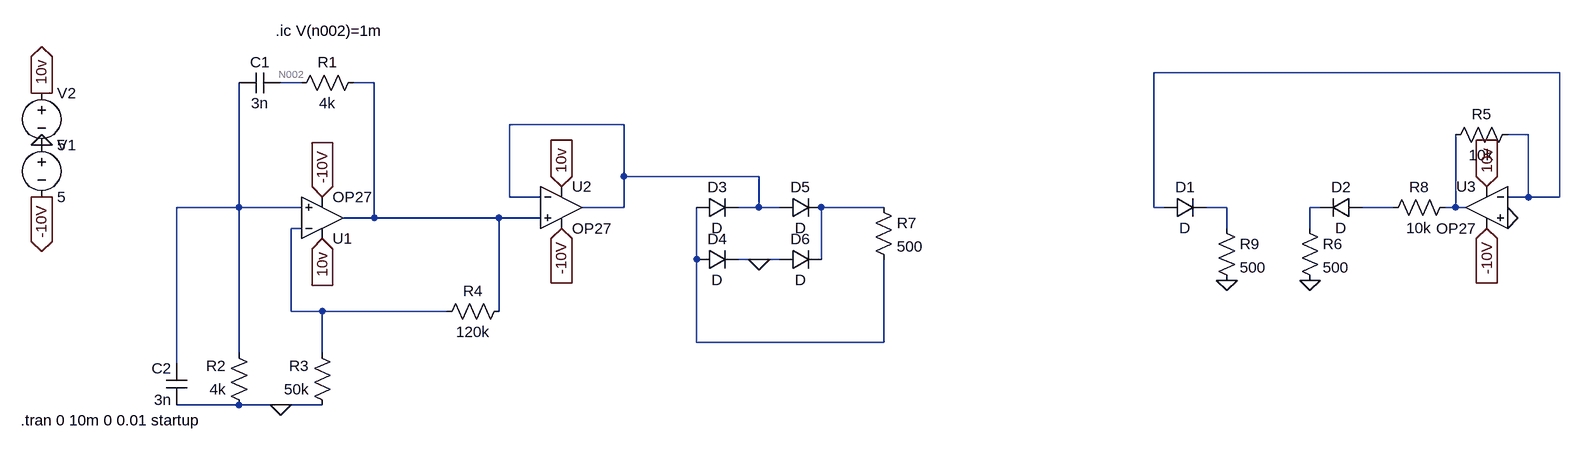
[diagram p0: schematic oscillator.asc]
oscillator.asc, the LTspice schematic file:
Version 4
SHEET 1 2164 680
WIRE 2160 -160 1536 -160
WIRE 224 -144 192 -144
WIRE 336 -144 304 -144
WIRE 720 -80 544 -80
WIRE 2112 -64 2080 -64
WIRE 720 0 720 -80
WIRE 928 0 720 0
WIRE 544 32 544 -80
WIRE 592 32 544 32
WIRE 2112 32 2112 -64
WIRE 2112 32 2080 32
WIRE 2160 32 2160 -160
WIRE 2160 32 2112 32
WIRE 128 48 128 -144
WIRE 128 48 32 48
WIRE 224 48 128 48
WIRE 720 48 720 0
WIRE 720 48 656 48
WIRE 928 48 928 0
WIRE 928 48 896 48
WIRE 960 48 928 48
WIRE 1120 48 1024 48
WIRE 1536 48 1536 -160
WIRE 1552 48 1536 48
WIRE 1648 48 1616 48
WIRE 1792 48 1776 48
WIRE 1904 48 1856 48
WIRE 2000 48 2000 -64
WIRE 2000 48 1984 48
WIRE 2016 48 2000 48
WIRE 336 64 336 -144
WIRE 336 64 288 64
WIRE 528 64 336 64
WIRE 592 64 528 64
WIRE 224 80 208 80
WIRE 1648 80 1648 48
WIRE 1776 80 1776 48
WIRE 832 128 832 48
WIRE 928 128 896 128
WIRE 960 128 928 128
WIRE 1024 128 1024 48
WIRE 208 208 208 80
WIRE 256 208 208 208
WIRE 448 208 256 208
WIRE 528 208 528 64
WIRE 832 256 832 128
WIRE 1120 256 1120 128
WIRE 1120 256 832 256
WIRE 128 272 128 48
WIRE 256 272 256 208
WIRE 32 288 32 48
WIRE 128 352 32 352
WIRE 192 352 128 352
WIRE 256 352 192 352
FLAG 192 352 0
FLAG 256 32 -10V
IOPIN 256 32 In
FLAG -176 -48 0
FLAG -176 -128 10v
IOPIN -176 -128 Out
FLAG 256 96 10v
IOPIN 256 96 In
FLAG -176 32 -10V
IOPIN -176 32 Out
FLAG 1648 160 0
FLAG 2080 64 0
FLAG 2048 80 -10V
IOPIN 2048 80 In
FLAG 624 80 -10V
IOPIN 624 80 In
FLAG 624 16 10v
IOPIN 624 16 In
FLAG 2048 16 10v
IOPIN 2048 16 In
FLAG 1776 160 0
FLAG 928 128 0
SYMBOL res 320 -160 R90
WINDOW 0 0 56 VBottom 2
WINDOW 3 32 56 VTop 2
SYMATTR InstName R1
SYMATTR Value 4k
SYMBOL res 144 368 R180
WINDOW 0 36 76 Left 2
WINDOW 3 36 40 Left 2
SYMATTR InstName R2
SYMATTR Value 4k
SYMBOL res 272 368 R180
WINDOW 0 36 76 Left 2
WINDOW 3 36 40 Left 2
SYMATTR InstName R3
SYMATTR Value 50k
SYMBOL res 432 224 R270
WINDOW 0 32 56 VTop 2
WINDOW 3 0 56 VBottom 2
SYMATTR InstName R4
SYMATTR Value 120k
SYMBOL cap 192 -160 R90
WINDOW 0 0 32 VBottom 2
WINDOW 3 32 32 VTop 2
SYMATTR InstName C1
SYMATTR Value 3n
SYMBOL cap 48 352 R180
WINDOW 0 24 56 Left 2
WINDOW 3 24 8 Left 2
SYMATTR InstName C2
SYMATTR Value 3n
SYMBOL voltage -176 -144 R0
WINDOW 123 0 0 Left 0
WINDOW 39 0 0 Left 0
SYMATTR InstName V2
SYMATTR Value 5
SYMBOL OpAmps\\OP27 256 128 M180
SYMATTR InstName U1
SYMBOL voltage -176 -64 R0
WINDOW 123 0 0 Left 0
WINDOW 39 0 0 Left 0
SYMATTR InstName V1
SYMATTR Value 5
SYMBOL OpAmps\\OP27 624 -16 R0
SYMATTR InstName U2
SYMBOL OpAmps\\OP27 2048 -16 M0
SYMATTR InstName U3
SYMBOL diode 1552 64 R270
WINDOW 0 32 32 VTop 2
WINDOW 3 0 32 VBottom 2
SYMATTR InstName D1
SYMBOL diode 1856 64 M270
WINDOW 0 32 32 VTop 2
WINDOW 3 0 32 VBottom 2
SYMATTR InstName D2
SYMBOL res 2096 -80 R90
WINDOW 0 0 56 VBottom 2
WINDOW 3 32 56 VTop 2
SYMATTR InstName R5
SYMATTR Value 10k
SYMBOL res 2000 32 R90
WINDOW 0 0 56 VBottom 2
WINDOW 3 32 56 VTop 2
SYMATTR InstName R8
SYMATTR Value 10k
SYMBOL res 1632 64 R0
SYMATTR InstName R9
SYMATTR Value 500
SYMBOL res 1760 64 R0
SYMATTR InstName R6
SYMATTR Value 500
SYMBOL diode 832 64 R270
WINDOW 0 32 32 VTop 2
WINDOW 3 0 32 VBottom 2
SYMATTR InstName D3
SYMBOL diode 832 144 R270
WINDOW 0 32 32 VTop 2
WINDOW 3 0 32 VBottom 2
SYMATTR InstName D4
SYMBOL diode 960 64 R270
WINDOW 0 32 32 VTop 2
WINDOW 3 0 32 VBottom 2
SYMATTR InstName D5
SYMBOL diode 960 144 R270
WINDOW 0 32 32 VTop 2
WINDOW 3 0 32 VBottom 2
SYMATTR InstName D6
SYMBOL res 1104 32 R0
SYMATTR InstName R7
SYMATTR Value 500
TEXT -208 376 Left 2 !.tran 0 10m 0 0.01 startup
TEXT 184 -224 Left 2 !.ic V(n002)=1m

The netlist it stands for:
* oscillator.asc
R1 N003 N002 4k
R2 0 N005 4k
R3 0 N011 50k
R4 N011 N003 120k
C1 N002 N005 3n
C2 0 N005 3n
V2 10v 0 5
XU1 N005 N011 10v -10V N003 OP27  ; pins In+ In- V+ V- OUT
V1 0 -10V 5
XU2 N003 N004 10v -10V N004 OP27  ; pins In+ In- V+ V- OUT
XU3 0 N001 10v -10V N010 OP27  ; pins In+ In- V+ V- OUT
D1 N001 N007 D
D2 N009 N008 D
R5 N001 N010 10k
R8 N010 N009 10k
R9 N007 0 500
R6 N008 0 500
D3 N012 N004 D
D4 N012 0 D
D5 N004 N006 D
D6 0 N006 D
R7 N006 N012 500
.model D D
.lib standard.dio
.tran 0 10m 0 0.01 startup
.ic V(n002)=1m
.lib ADI.lib
.backanno
.end